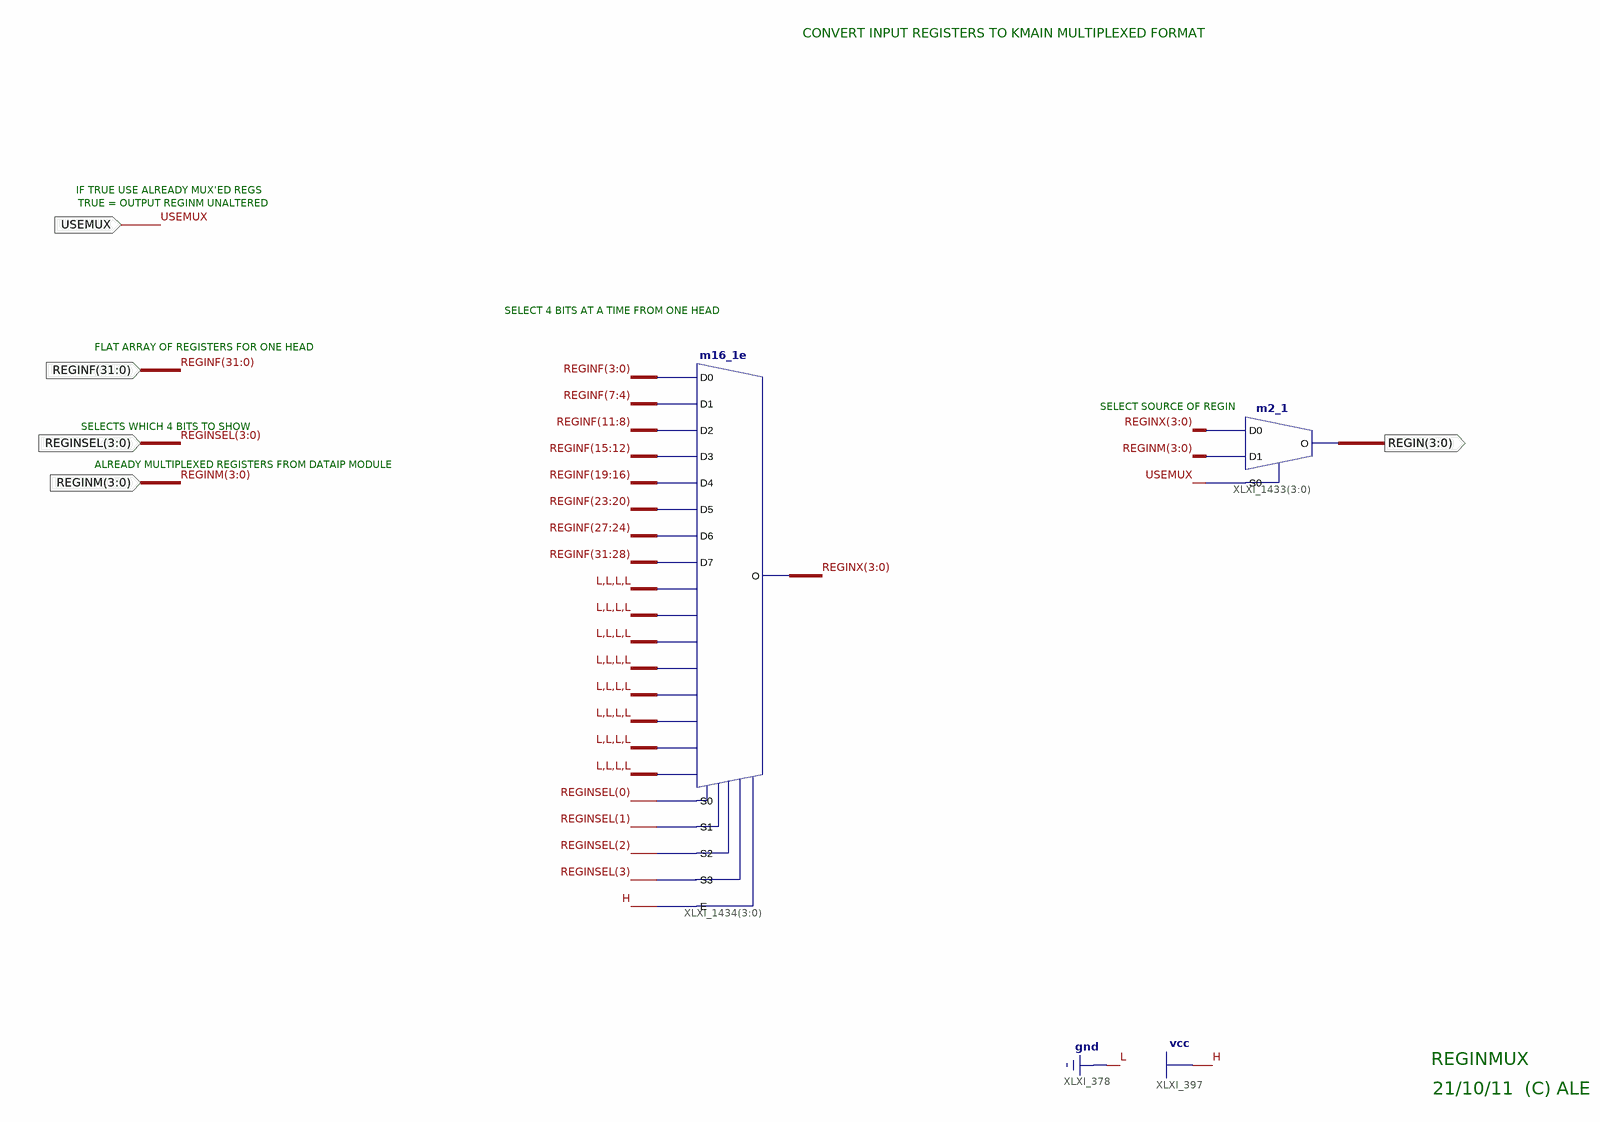
[diagram p0: schematic sheet 1]
// Xilinx ISE schematic DB_ReginMux.sch (spartan3e) as structural Verilog: 2 symbols, 5 ports
module DB_ReginMux (
  input  [3:0] REGINM,
  input  USEMUX,
  input  [31:0] REGINF,
  input  [3:0] REGINSEL,
  output [3:0] REGIN
);

  wire [3:0] REGINX;

  m2_1 XLXI_1433[3:0] (.D0(REGINX), .D1(REGINM), .S0(USEMUX), .O(REGIN));
  m16_1e XLXI_1434[3:0] (
    .D0(REGINF[3:0]), .D1(REGINF[7:4]), .D10(4'b0000), .D11(4'b0000), .D12(4'b0000), .D13(4'b0000),
    .D14(4'b0000), .D15(4'b0000), .D2(REGINF[11:8]), .D3(REGINF[15:12]), .D4(REGINF[19:16]),
    .D5(REGINF[23:20]), .D6(REGINF[27:24]), .D7(REGINF[31:28]), .D8(4'b0000), .D9(4'b0000), .E(1'b1),
    .S0(REGINSEL[0]), .S1(REGINSEL[1]), .S2(REGINSEL[2]), .S3(REGINSEL[3]), .O(REGINX));

  // Notes on the sheet:
  //   CONVERT INPUT REGISTERS TO KMAIN MULTIPLEXED FORMAT
  //   IF TRUE USE ALREADY MUX'ED REGS
  //   TRUE = OUTPUT REGINM UNALTERED
  //   SELECT 4 BITS AT A TIME FROM ONE HEAD
  //   FLAT ARRAY OF REGISTERS FOR ONE HEAD
  //   SELECT SOURCE OF REGIN
  //   SELECTS WHICH 4 BITS TO SHOW
  //   ALREADY MULTIPLEXED REGISTERS FROM DATAIP MODULE
  //   REGINMUX
  //   21/10/11  (C) ALE
endmodule
